# Altium schematic sheet 12V_REG.SchDoc
size C; SheetNumber: 17; SheetTotal: 25
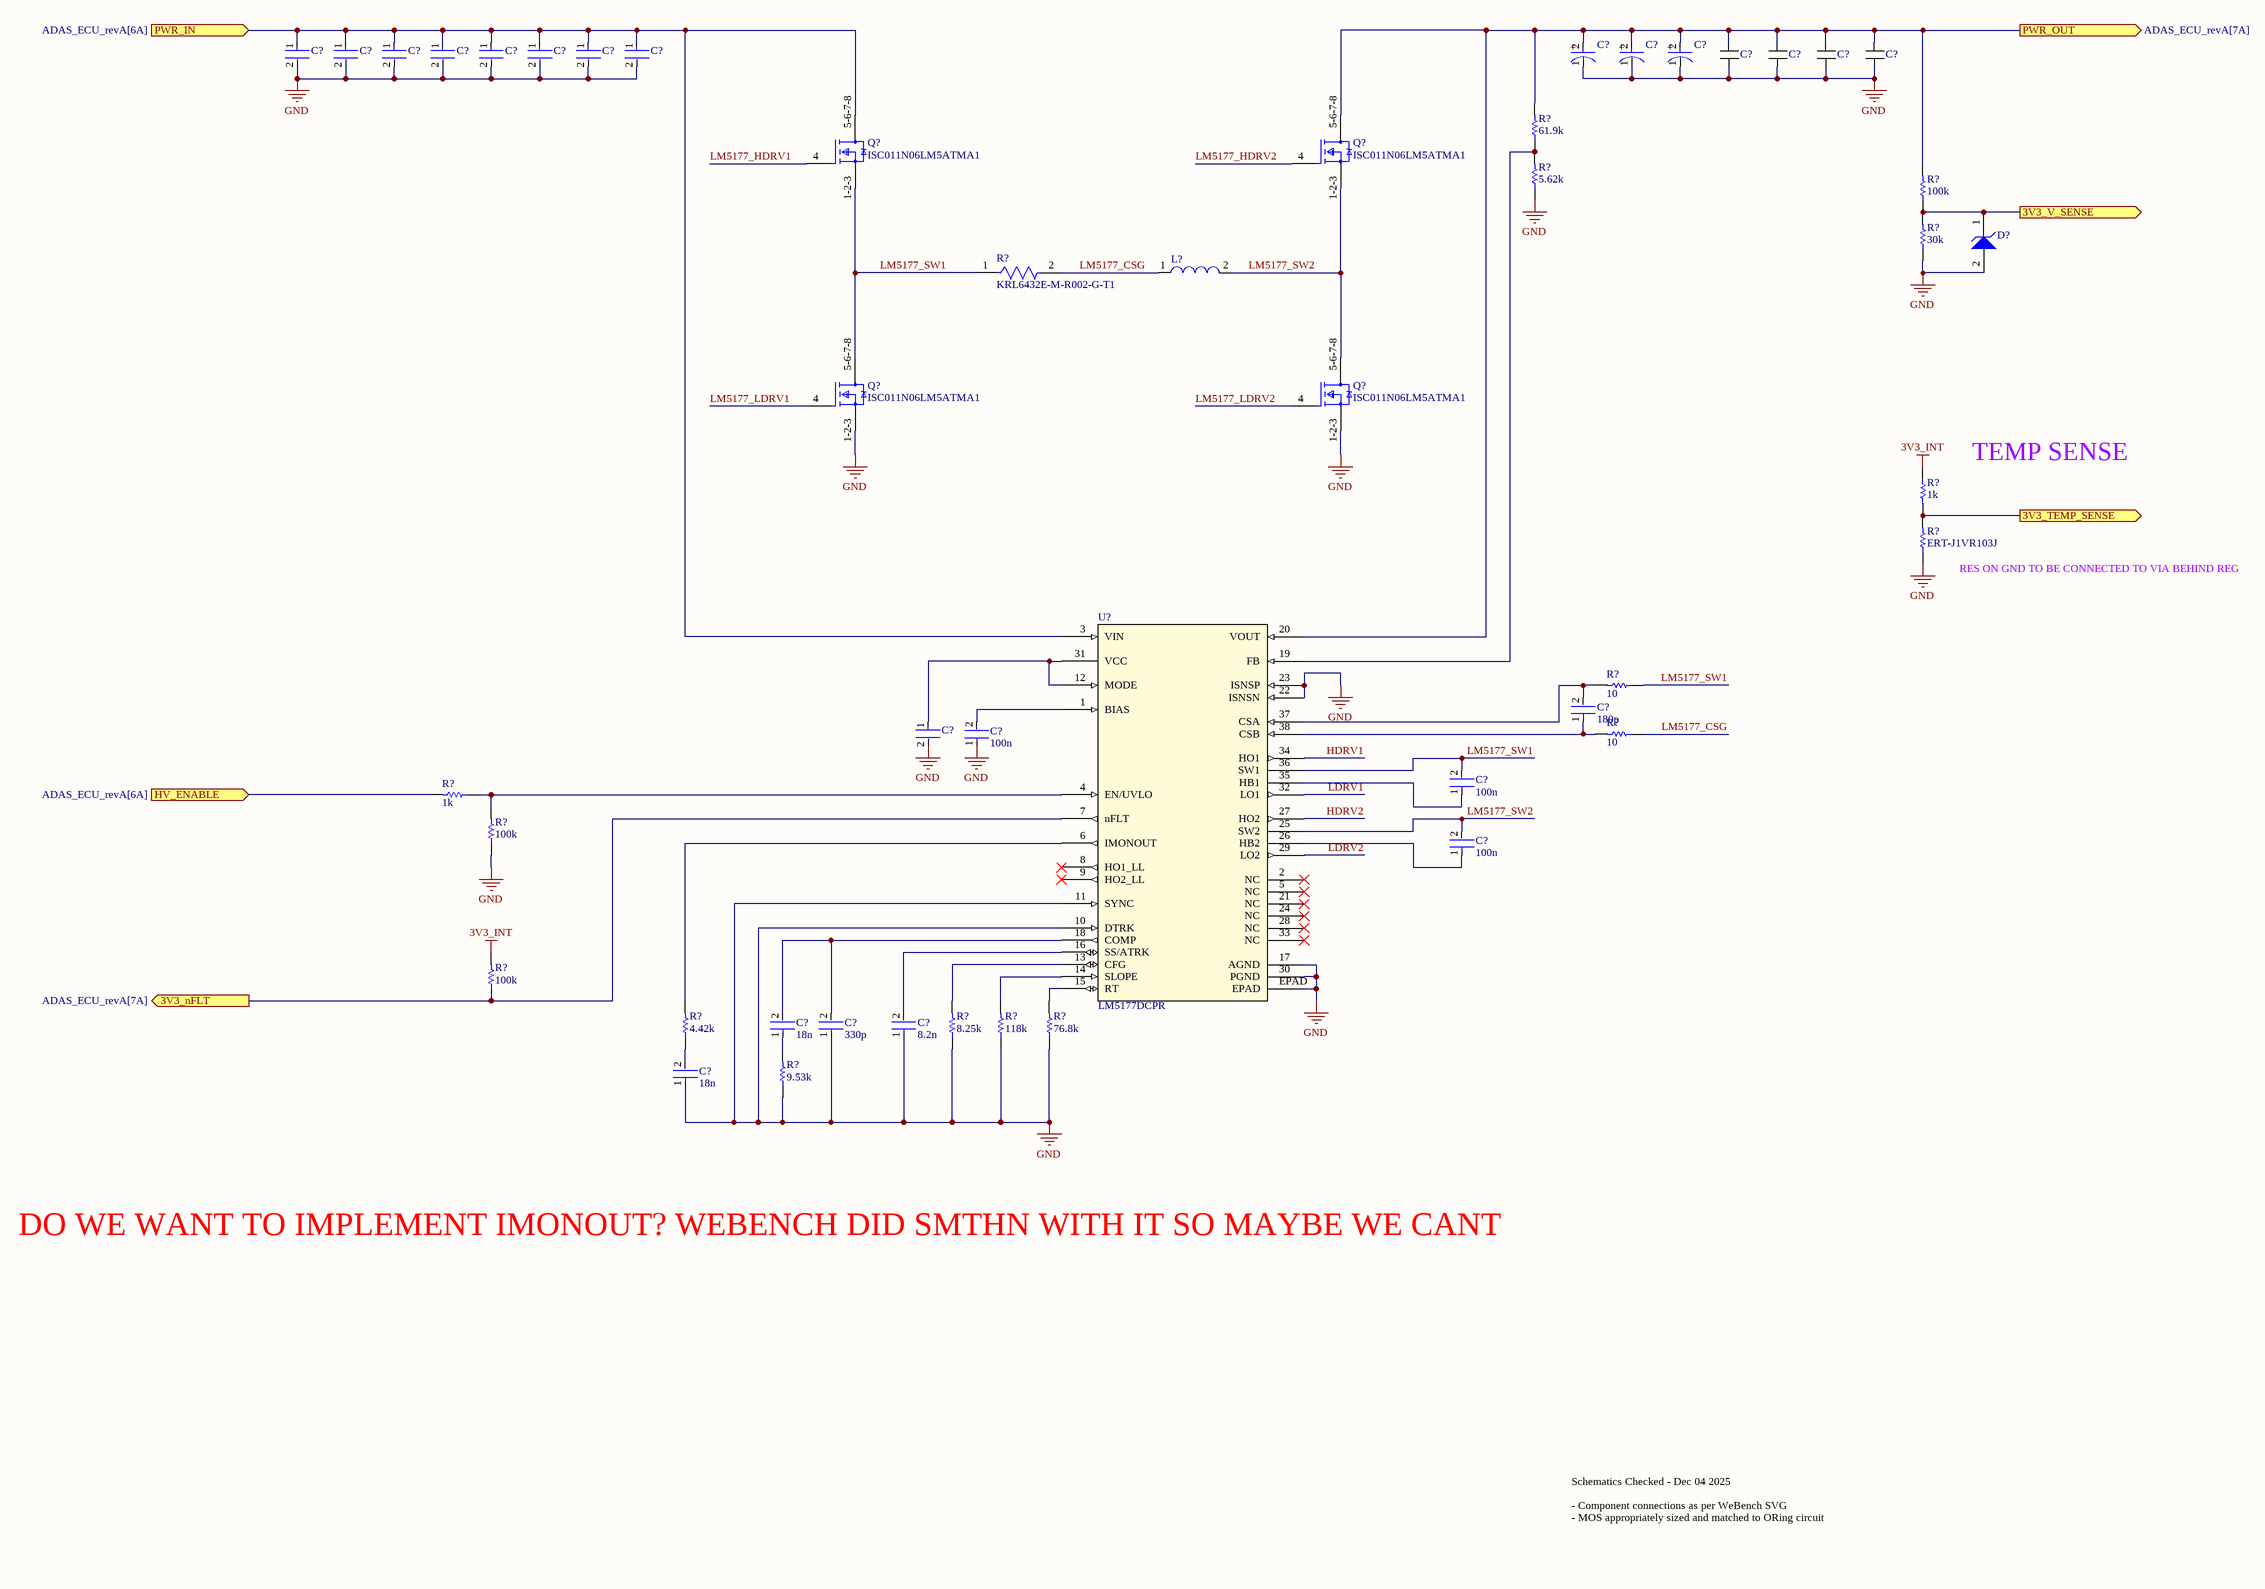
[diagram p0: 12V_REG.SchDoc]

## Parts
(Parts that share a designator on the sheet are numbered #1, #2 ... from top to bottom, then left to right.)
C?#1  C3225X7R1H106M250AC  [FP-C3225-250-0_4-MFG]  (value not drawn)
C?#2  C3225X7R1H106M250AC  [FP-C3225-250-0_4-MFG]  (value not drawn)
C?#3  C3225X7R1H106M250AC  [FP-C3225-250-0_4-MFG]  (value not drawn)
C?#4  C3225X7R1H106M250AC  [FP-C3225-250-0_4-MFG]  (value not drawn)
C?#5  C3225X7R1H106M250AC  [FP-C3225-250-0_4-MFG]  (value not drawn)
C?#6  C3225X7R1H106M250AC  [FP-C3225-250-0_4-MFG]  (value not drawn)
C?#7  C3225X7R1H106M250AC  [FP-C3225-250-0_4-MFG]  (value not drawn)
C?#8  C3225X7R1H106M250AC  [FP-C3225-250-0_4-MFG]  (value not drawn)
C?#9  20SVPF120M  [FP-OS-CON-SMT-C6-MFG]  (value not drawn)
C?#10  20SVPF120M  [FP-OS-CON-SMT-C6-MFG]  (value not drawn)
C?#11  20SVPF120M  [FP-OS-CON-SMT-C6-MFG]  (value not drawn)
C?#12  CGA9P2X7R1E226M250KA  [CGA9P2X7R1E226M250KA-Footprint-1]  (value not drawn)
C?#13  CGA9P2X7R1E226M250KA  [CGA9P2X7R1E226M250KA-Footprint-1]  (value not drawn)
C?#14  CGA9P2X7R1E226M250KA  [CGA9P2X7R1E226M250KA-Footprint-1]  (value not drawn)
C?#15  CGA9P2X7R1E226M250KA  [CGA9P2X7R1E226M250KA-Footprint-1]  (value not drawn)
C?#16  GRM188R60J226MEA0D  [FP-GRM188-0_1-e0_2_0_5-MFG]  (value not drawn)
C?#17  180p  [FP-0402-L_1_0_0_05-W_0_5-IPC_A]
C?#18  100n  [FP-0402-L_1_0_0_05-W_0_5-IPC_A]
C?#19  100n  [FP-0402-L_1_0_0_05-W_0_5-IPC_A]
C?#20  100n  [FP-0402-L_1_0_0_05-W_0_5-IPC_A]
C?#21  18n  [FP-0402-L_1_0_0_05-W_0_5-IPC_A]
C?#22  330p  [FP-0402-L_1_0_0_05-W_0_5-IPC_A]
C?#23  8.2n  [FP-0402-L_1_0_0_05-W_0_5-IPC_A]
C?#24  18n  [FP-0402-L_1_0_0_05-W_0_5-IPC_A]
D?  MM5Z3V3T1G  [ONSC-SOD-523-2-502-01_V]  (value not drawn)
L?  HC2LP-4R7-R  [HC2LP-4R7-R-Footprint-1]  (value not drawn)
Q?#1  ISC011N06LM5ATMA1  [FP-PG-TDSON-8-MFG]
Q?#2  ISC011N06LM5ATMA1  [FP-PG-TDSON-8-MFG]
Q?#3  ISC011N06LM5ATMA1  [FP-PG-TDSON-8-MFG]
Q?#4  ISC011N06LM5ATMA1  [FP-PG-TDSON-8-MFG]
R?#1  61.9k  [R0603B]
R?#2  5.62k  [R0603B]
R?#3  100k  [R0603B]
R?#4  30k  [R0603B]
R?#5  KRL6432E-M-R002-G-T1  [FP-KRL6432E-MFG]
R?#6  1k  [R0603B]
R?#7  ERT-J1VR103J  [RESC1608X90X30ML15T20]
R?#8  10  [R0603B]
R?#9  10  [R0603B]
R?#10  1k  [R0603B]
R?#11  100k  [R0603B]
R?#12  100k  [R0603B]
R?#13  4.42k  [R0603B]
R?#14  8.25k  [R0603B]
R?#15  118k  [R0603B]
R?#16  76.8k  [R0603B]
R?#17  9.53k  [R0603B]
U?  LM5177DCPR  [LM5177DCPR-Footprint-1]

## Ports
3V3_nFLT (out, see ADAS_ECU_revA[7A]), 3V3_TEMP_SENSE (out), 3V3_V_SENSE (out), HV_ENABLE (in, see ADAS_ECU_revA[6A]), PWR_IN (in, see ADAS_ECU_revA[6A]), PWR_OUT (out, see ADAS_ECU_revA[7A])

## Nets
3V3_INT: R?#6.1 R?#12.2
GND: C?#1.2 C?#2.2 C?#3.2 C?#4.2 C?#5.2 C?#6.2 C?#7.2 C?#8.2 C?#9.1(C) C?#10.1(C) C?#11.1(C) C?#12.2 C?#13.2 C?#14.2 C?#15.2 C?#16.2 C?#18.1 C?#22.1 C?#23.1 C?#24.1 D?.2(A) Q?#3.1-2-3(S) Q?#4.1-2-3(S) R?#2.1 R?#4.1 R?#7.1 R?#11.1 R?#14.1 R?#15.1 R?#16.1 R?#17.1 U?.10(DTRK) U?.11(SYNC) U?.17(AGND) U?.22(ISNSN) U?.23(ISNSP) U?.30(PGND) U?.EPAD
3V3_nFLT: R?#12.1 U?.7(nFLT) ; port 3V3_nFLT
3V3_TEMP_SENSE: R?#6.2 R?#7.2 ; port 3V3_TEMP_SENSE
3V3_V_SENSE: D?.1(K) R?#3.1 R?#4.2 ; port 3V3_V_SENSE
HDRV1: U?.34(HO1)
HDRV2: U?.27(HO2)
HV_ENABLE: R?#10.2 ; port HV_ENABLE
LDRV1: U?.32(LO1)
LDRV2: U?.29(LO2)
LM5177_CSG: L?.1 R?#5.2 R?#9.1
LM5177_HDRV1: Q?#1.4(G)
LM5177_HDRV2: Q?#2.4(G)
LM5177_LDRV1: Q?#3.4(G)
LM5177_LDRV2: Q?#4.4(G)
LM5177_SW1: C?#19.2 Q?#1.1-2-3(S) Q?#3.5-6-7-8(D) R?#5.1 R?#8.1 U?.36(SW1)
LM5177_SW2: C?#20.2 L?.2 Q?#2.1-2-3(S) Q?#4.5-6-7-8(D) U?.25(SW2)
PWR_IN: C?#1.1 C?#2.1 C?#3.1 C?#4.1 C?#5.1 C?#6.1 C?#7.1 C?#8.1 Q?#1.5-6-7-8(D) U?.3(VIN) ; port PWR_IN
PWR_OUT: C?#9.2(A) C?#10.2(A) C?#11.2(A) C?#12.1 C?#13.1 C?#14.1 C?#15.1 Q?#2.5-6-7-8(D) R?#1.2 R?#3.2 U?.20(VOUT) ; port PWR_OUT
NetC?#16_1: C?#16.1 U?.12(MODE) U?.31(VCC)
NetC?#17_1: C?#17.1 R?#9.2 U?.38(CSB)
NetC?#17_2: C?#17.2 R?#8.2 U?.37(CSA)
NetC?#18_2: C?#18.2 U?.1(BIAS)
NetC?#19_1: C?#19.1 U?.35(HB1)
NetC?#20_1: C?#20.1 U?.26(HB2)
NetC?#21_1: C?#21.1 R?#17.2
NetC?#21_2: C?#21.2 C?#22.2 U?.18(COMP)
NetC?#23_2: C?#23.2 U?.16(SS/ATRK)
NetC?#24_2: C?#24.2 R?#13.1
NetR?#1_1: R?#1.1 R?#2.2 U?.19(FB)
NetR?#10_1: R?#10.1 R?#11.2 U?.4(EN/UVLO)
NetR?#13_2: R?#13.2 U?.6(IMONOUT)
NetR?#14_2: R?#14.2 U?.13(CFG)
NetR?#15_2: R?#15.2 U?.14(SLOPE)
NetR?#16_2: R?#16.2 U?.15(RT)

Not connected (* = marked no-connect by the designer): U? 2(NC)* 5(NC)* 8(HO1_LL)* 9(HO2_LL)* 21(NC)* 24(NC)* 28(NC)* 33(NC)*

## Notes on the sheet
- TEMP SENSE
- (near R?#7) RES ON GND TO BE CONNECTED TO VIA BEHIND REG
- DO WE WANT TO IMPLEMENT IMONOUT? WEBENCH DID SMTHN WITH IT SO MAYBE WE CANT
- Schematics Checked - Dec 04 2025
  - Component connections as per WeBench SVG
  - MOS appropriately sized and matched to ORing circuit
- (in symbol CMP-05428-001333-1) +

## Library data of the parts
C?#1-C?#8 = CMP-08246-002653-1: Multilayer Ceramic Capacitors 10uF ±20% 50V X7R SMD 1210; Width: 0.098inch; Package Quantity: 1000; Height: 2.5mm; Dielectric Material: Ceramic; Voltage Rating: 50V; Series: C; Capacitance: 10uF; Tolerance: 20%; Weight: 0.000564oz; Case/Package: 1210; Case Code (Imperial): 1210; Dielectric: X7R; Case Code (Metric): 3225; REACH SVHC: No SVHC; Packaging: Tape and Reel; Length: 0.126inch; Termination: SMD/SMT; Min Operating Temperature: -55°C; Voltage Rating (DC): 50V; Lead Free: Lead Free; Max Operating Temperature: 125°C; Thickness: 0.11inch; Mount: Surface Mount
C?#9-C?#11 = CMP-05428-001333-1: Conductive Polymer Aluminum Solid Capacitors (OS-CON) 120uF ±20% 20V; Polarity: Polar; ESR (Equivalent Series Resistance): 25mR; Leakage Current: 480uA; Ripple Current: 3.2A; Life (Hours): 5000Hour; Dissipation Factor: 12%; Lead Free: Lead Free; Voltage Rating: 20V; Packaging: Tape and Reel; Min Operating Temperature: -55°C; Tolerance: 20%; Diameter: 6.3mm; Max Operating Temperature: 105°C; Length: 5.9mm; Termination: SMD/SMT; Height - Seated (Max): 0.236inch; REACH SVHC: No SVHC; Voltage Rating (DC): 20V; Voltage: 20V; Material: Polymer; Ripple Current (AC): 3.2A; Series: OS-CON™, SVPF; RoHS Compliant: Yes; Mount: Surface Mount; Height: 5.9mm; Package Quantity: 1000; Radiation Hardening: No; Construction: Cylindrical; Case/Package: Radial; Capacitance: 120uF; Number of Pins: 6
C?#12-C?#15 = CMP-001-00071-1: 25V 22uF X7R 卤20% 2220 Multilayer Ceramic Capacitors MLCC - SMD/SMT ROHS; Tolerance: 20%; Value: 22µF; Mounting Technology: Surface Mount; Voltage Rating: 25V; Min Operating Temperature: -55°C; Case/Package: 2220; Max Operating Temperature: 125°C
C?#16 = CMP-2006-02836-2: 22uF cap, diff pn; Voltage: 10V; Dielectric: X7R; Material: Ceramic; Capacitance: 2.2uF; Tolerance: 10%; Case Code (Metric): 1608; Height: 0.8mm; Packaging: Cut Tape; Lead Free: Lead Free; Min Operating Temperature: -55°C; Voltage Rating (DC): 10V; Max Operating Temperature: 125°C; Voltage Rating: 10V; Depth: 0.8mm; Case Code (Imperial): 0603; Termination: SMD/SMT; Case/Package: 0603; Number of Pins: 2; REACH SVHC: No SVHC; Mount: Surface Mount; Width: 0.031inch; Package Quantity: 1; Weight: 7.1E-05oz; Length: 1.6mm; Thickness: 0.035inch
C?#17-C?#24 = CMP-001-00058-1: LARGE PADS, 0402 CAP, CHANGE COMMENT TO MATCH REAL P/N; Capacitor Type: Ceramic; Min Operating Temperature: -55°C; Mounting Technology: Surface Mount; Pins: 2; Case/Package: 0402; RoHS Compliant: Yes; Max Operating Temperature: 85°C
D? = CMP-1060-00750-1: Zener Voltage Regulator, 500 mW, 2-Pin SOD-523, Pb-Free, Tape and Reel; Manufacturer: On Semiconductor; P Max (W): 0.5; VZ Typ (V): 3.3; RoHS: Pb-Free; ComponentLink2Description: Datasheet; PackageReference: SOD-523-2-502-01; DatasheetVersion: Rev. 10; ComponentLink1Description: Manufacturer URL; PackageVersion: Rev. E, 09/2010; ComponentLink3URL: http://www.onsemi.com/pub_link/Collateral/502-01.PDF; ComponentLink2URL: http://www.onsemi.cn/pub_link/Collateral/MM5Z2V4T1-D.PDF; Mounting Technology: Surface Mount; PartNumber: MM5Z3V3T1G; Packing: Tape and Reel; PackageDescription: 2-Pin SOD, Body 1.2 x 0.8 mm; ComponentLink1URL: http://www.onsemi.com/; ComponentLink3Description: Package Specification
L? = CMP-006-00034-1: Inductor Power Wirewound 4.7uH 20% 300KHz Ferrite 17A 4.6mOhm DCR T/R; Mounting Technology: Surface Mount; Case/Package: Nonstandard; Max Operating Temperature: 85°C; Tolerance: 20%; Min Operating Temperature: -40°C; Pins: 2
Q?#1-Q?#4 = CMP-32901-001049-1: TRENCH 40<-<100V PG-TDSON-8
R?#1-R?#4 R?#6 R?#8-R?#17 = CMP-009-00002-14: Resistor
  R?#6: Value: 1k
R?#5 = CMP-00597-24927455-1: KRL6432E-M-R002-G-T1 Metal Foil Low Resistance Chip Resistor (long-side terminal), 2512, RoHS; Power Rating: 3W; Tolerance: 2%; Resistance: 2mΩ; Temperature Coefficient: 100ppm/°C; Width: 6.3mm; Termination: SMD/SMT; Weight: 40.511469mg; RoHS: Compliant; Lifecycle Status: Production; Case Code (Imperial): 2512; Case Code (Metric): 6432; Case/Package: 2512; Height: 700µm; Length: 3.1mm; Max Thickness: 700µm; Min Operating Temperature: -55°C; NexarPartId: 24927455; Composition: Metal Foil; Max Operating Temperature: 155°C
R?#7 = CMP-2000-00869-1: Manufacturer: Panasonic; Part Number: ERT-J1VR103J
U? = CMP-019-00059-2: IC Buck-Boost Regulator Positive Output Step-Up/Step-Down DC-DC Controller IC 38-HTSSOP; Pins: 38